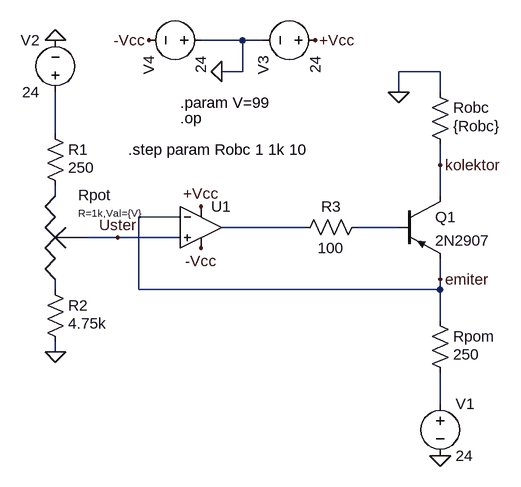
[diagram p0: schematic Uklad2_lab3.asc]
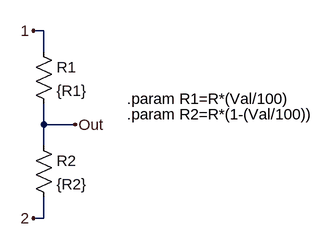
[diagram p1: sub-circuit potentiometer.asc]
Uklad2_lab3.asc, the LTspice schematic file:
Version 4
SHEET 1 880 680
WIRE -48 -112 -112 -112
WIRE -16 -112 -48 -112
WIRE -48 -64 -48 -112
WIRE -48 -64 -80 -64
WIRE 256 -64 192 -64
WIRE 192 -32 192 -64
WIRE 256 -32 256 -64
WIRE -336 32 -336 -32
WIRE 256 80 256 48
WIRE -336 128 -336 112
WIRE 256 128 256 80
WIRE -144 160 -208 160
WIRE 48 176 -80 176
WIRE 192 176 128 176
WIRE -240 192 -288 192
WIRE -144 192 -240 192
WIRE 256 256 256 224
WIRE -336 272 -336 256
WIRE -208 272 -208 160
WIRE 256 272 256 256
WIRE 256 272 -208 272
WIRE 256 320 256 272
WIRE -336 368 -336 352
WIRE 256 448 256 400
FLAG 192 -32 0
FLAG 256 528 0
FLAG -336 368 0
FLAG -336 -112 0
FLAG -240 192 Uster
FLAG 256 80 kolektor
FLAG 256 256 emiter
FLAG -80 -64 0
FLAG 64 -112 +Vcc
FLAG -112 144 +Vcc
FLAG -192 -112 -Vcc
FLAG -112 208 -Vcc
SYMBOL res 240 304 R0
WINDOW 3 36 68 Left 2
SYMATTR Value 250
SYMATTR InstName Rpom
SYMBOL res 240 -48 R0
WINDOW 3 36 68 Left 2
SYMATTR Value {Robc}
SYMATTR InstName Robc
SYMBOL res 144 160 R90
WINDOW 0 0 56 VBottom 2
WINDOW 3 32 56 VTop 2
SYMATTR InstName R3
SYMATTR Value 100
SYMBOL res -352 16 R0
WINDOW 3 36 68 Left 2
SYMATTR Value 250
SYMATTR InstName R1
SYMBOL res -352 256 R0
WINDOW 3 36 68 Left 2
SYMATTR Value 4.75k
SYMATTR InstName R2
SYMBOL Potentiometer -336 192 R0
WINDOW 0 35 -66 Left 2
WINDOW 39 35 -38 Left 1
SYMATTR InstName Rpot
SYMATTR SpiceLine R=1k,Val={V}
SYMBOL pnp 192 128 R0
SYMATTR InstName Q1
SYMATTR Value 2N2907
SYMBOL voltage 256 432 R0
WINDOW 123 0 0 Left 0
WINDOW 39 0 0 Left 0
SYMATTR InstName V1
SYMATTR Value 24
SYMBOL OpAmps\\UniversalOpamp2 -112 176 R0
SYMATTR InstName U1
SYMBOL voltage -336 -16 R180
WINDOW 0 24 96 Left 2
WINDOW 3 24 16 Left 2
WINDOW 123 0 0 Left 0
WINDOW 39 0 0 Left 0
SYMATTR InstName V2
SYMATTR Value 24
SYMBOL voltage 80 -112 R90
WINDOW 0 24 96 Left 2
WINDOW 3 24 16 Left 2
WINDOW 123 0 0 Left 0
WINDOW 39 0 0 Left 0
SYMATTR InstName V3
SYMATTR Value 24
SYMBOL voltage -96 -112 R90
WINDOW 0 24 96 Left 2
WINDOW 3 24 16 Left 2
WINDOW 123 0 0 Left 0
WINDOW 39 0 0 Left 0
SYMATTR InstName V4
SYMATTR Value 24
TEXT -144 -16 Left 2 !.param V=99
TEXT -144 8 Left 2 !.op
TEXT -224 56 Left 2 !.step param Robc 1 1k 10

potentiometer.asc, the sub-circuit schematic file:
Version 4
SHEET 1 880 680
WIRE 144 16 128 16
WIRE 144 48 144 16
WIRE 144 160 144 128
WIRE 192 160 144 160
WIRE 144 192 144 160
WIRE 144 304 144 272
WIRE 144 304 128 304
FLAG 128 16 1
FLAG 128 304 2
FLAG 192 160 Out
SYMBOL res 128 32 R0
SYMATTR InstName R1
SYMATTR Value {R1}
SYMBOL res 128 176 R0
SYMATTR InstName R2
SYMATTR Value {R2}
TEXT 272 120 Left 2 !.param R1=R*(Val/100)
TEXT 272 144 Left 2 !.param R2=R*(1-(Val/100))

The netlist it stands for:
* Uklad2_lab3.asc
Rpom emiter N006 250
Robc 0 kolektor {Robc}
R3 N004 N003 100
R1 N001 N002 250
R2 N005 0 4.75k
XRpot N002 N005 Uster potentiometer params: R=1k,Val={V}
Q1 kolektor N004 emiter 0 2N2907
V1 N006 0 24
XU1 Uster emiter +Vcc -Vcc N003 level.2 Avol=1Meg GBW=10Meg Slew=10Meg ilimit=25m rail=0 Vos=0 phimargin=45 en=0 enk=0 in=0 ink=0 Rin=500Meg  ; pins IN+ IN- V+ V- OUT
V2 N001 0 24
V3 +Vcc 0 24
V4 0 -Vcc 24

* block symbol definitions
.subckt potentiometer 1 2 Out
R1 1 Out {R1}
R2 Out 2 {R2}
.param R1=R*(Val/100)
.param R2=R*(1-(Val/100))
.ends potentiometer

.model NPN NPN
.model PNP PNP
.lib standard.bjt
.param V=99
.op
.step param Robc 1 1k 10
.lib UniversalOpamps2.sub
.backanno
.end